# EAGLE design adapter (EAGLE 5.10)
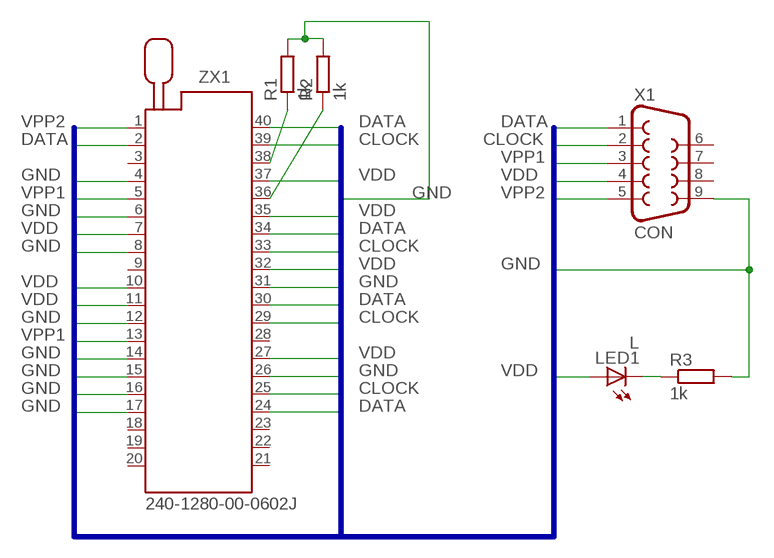
[diagram p0: schematic, sheet 1]

## Parts
LED1  L  LED5MM  [LED5MM]
R1  1k  R-EU_0204/7  [0204/7]
R2  1k  R-EU_0204/7  [0204/7]
R3  1k  R-EU_0204/7  [0204/7]
X1  CON  F09HP  [F09HP]
ZX1  240-1280-00-0602J  [240-1280-00-0602J]

## Nets
CLOCK: X1.2 ZX1.25 ZX1.29 ZX1.33 ZX1.39
DATA: X1.1 ZX1.2 ZX1.24 ZX1.30 ZX1.34 ZX1.40
GND: R1.2 R2.2 R3.2 X1.9 ZX1.4 ZX1.6 ZX1.8 ZX1.12 ZX1.14 ZX1.15 ZX1.16 ZX1.17 ZX1.26 ZX1.31
N$1: LED1.K(C) R3.1
N$2: R1.1 ZX1.38
N$3: R2.1 ZX1.36
VDD: LED1.A X1.4 ZX1.7 ZX1.10 ZX1.11 ZX1.27 ZX1.32 ZX1.35 ZX1.37
VPP1: X1.3 ZX1.5 ZX1.13
VPP2: X1.5 ZX1.1
Unconnected: X1.6 X1.7 X1.8 ZX1.3 ZX1.9 ZX1.18 ZX1.19 ZX1.20 ZX1.21 ZX1.22 ZX1.23 ZX1.28

## Buses
DATA,CLOCK,VPP1,VDD,VPP2,GND

## Library data of the parts
LED1 = led:LED: LED OSRAM: - CHIPLED LG R971, LG N971, LY N971, LG Q971, LY Q971, LO R971, LY R971 LH N974, LH R974 LS Q976, LO Q976, LY Q976 LO Q996 - Hyper CHIPLED LW Q18S LB Q993, LB Q99A, LB R99A - SideLED LS A670, LO A670, LY A670, LG A670, LP A670 LB A673, LV A673, LT A673, LW A673 LH A674 LY A675 LS A676, LA A676, LO A676, LY A676, LW A676 LS A679, LY A679, LG A679 - Hyper Micro SIDELED® LS Y876, LA Y876, LO Y876, LY Y876 LT Y87S - SmartLED LW L88C, LW L88S LB L89C, LB L89S, LG L890 LS L89K, LO L89K, LY L89K LS L896, LA L896, LO L896, LY L896 - TOPLED LS T670, LO T670, LY T670, LG T670, LP T670 LSG T670, LSP T670, LSY T670, LOP T670, LYG T670 LG T671, LOG T671, LSG T671 LB T673, LV T673, LT T673, LW T673 LH T674 LS T676, LA T676, LO T676, LY T676, LB T676, LH T676, LSB T676, LW T676 LB T67C, LV T67C, LT T67C, LS T67K, LO T67K, LY T67K, LW E67C LS E67B, LA E67B, LO E67B, LY E67B, LB E67C, LV E67C, LT E67C LW T67C LS T679, LY T679, LG T679 LS T770, LO T770, LY T770, LG T770, LP T770 LB T773, LV T773, LT T773, LW T773 LH T774 LS E675, LA E675, LY E675, LS T675 LS T776, LA T776, LO T776, LY T776, LB T776 LHGB T686 LT T68C, LB T68C - Hyper Mini TOPLED® LB M676 - Mini TOPLED Santana® LG M470 LS M47K, LO M47K, LY M47K Source: http://www.osram.convergy.de LUXEON: - LUMILED® LXK2-PW12-R00, LXK2-PW12-S00, LXK2-PW14-U00, LXK2-PW14-V00 LXK2-PM12-R00, LXK2-PM12-S00, LXK2-PM14-U00 LXK2-PE12-Q00, LXK2-PE12-R00, LXK2-PE12-S00, LXK2-PE14-T00, LXK2-PE14-U00 LXK2-PB12-K00, LXK2-PB12-L00, LXK2-PB12-M00, LXK2-PB14-N00, LXK2-PB14-P00, LXK2-PB14-Q00 LXK2-PR12-L00, LXK2-PR12-M00, LXK2-PR14-Q00, LXK2-PR14-R00 LXK2-PD12-Q00, LXK2-PD12-R00, LXK2-PD12-S00 LXK2-PH12-R00, LXK2-PH12-S00 LXK2-PL12-P00, LXK2-PL12-Q00, LXK2-PL12-R00 Source: www.luxeon.com KINGBRIGHT: KA-3528ASYC Source: www.kingbright.com
R1-R3 = resistor:R-EU_: RESISTOR, European symbol
X1 = con-subd:F09: SUB-D
ZX1 = con-3m:240-?-00-0602J: Zero Insertion Force Socked Source: http://www.3M.com/ehpd

## Board
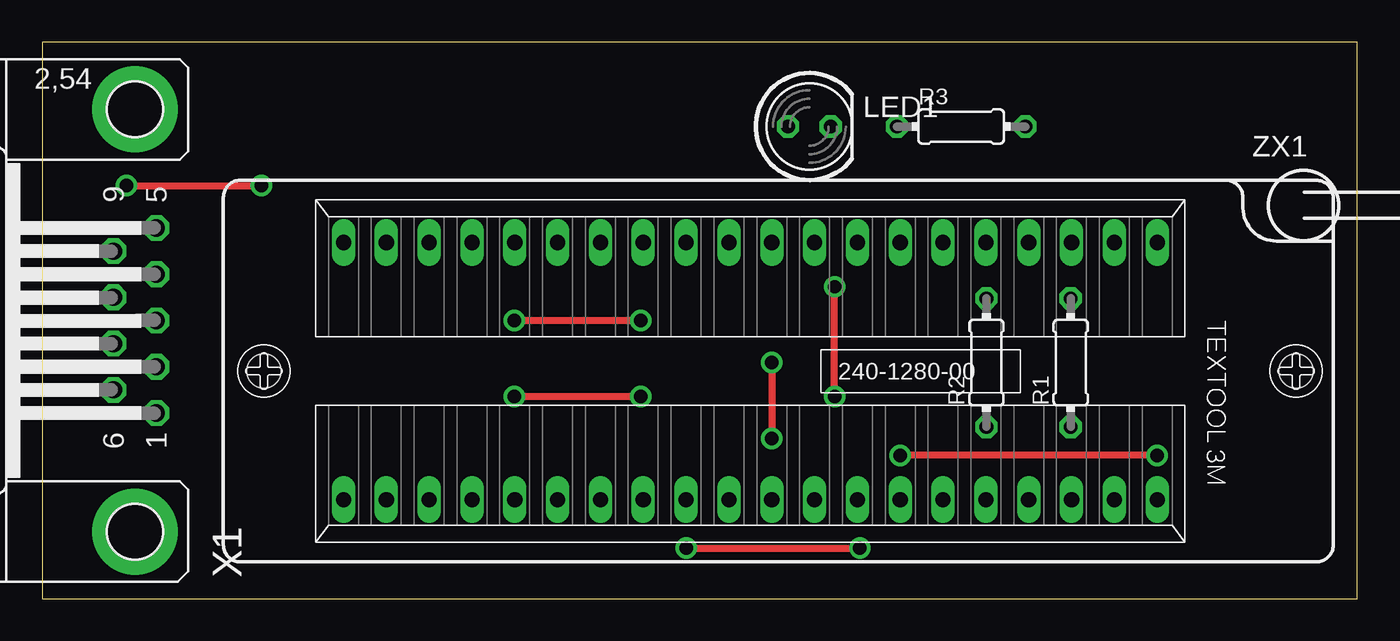
[diagram p1: board, top side]
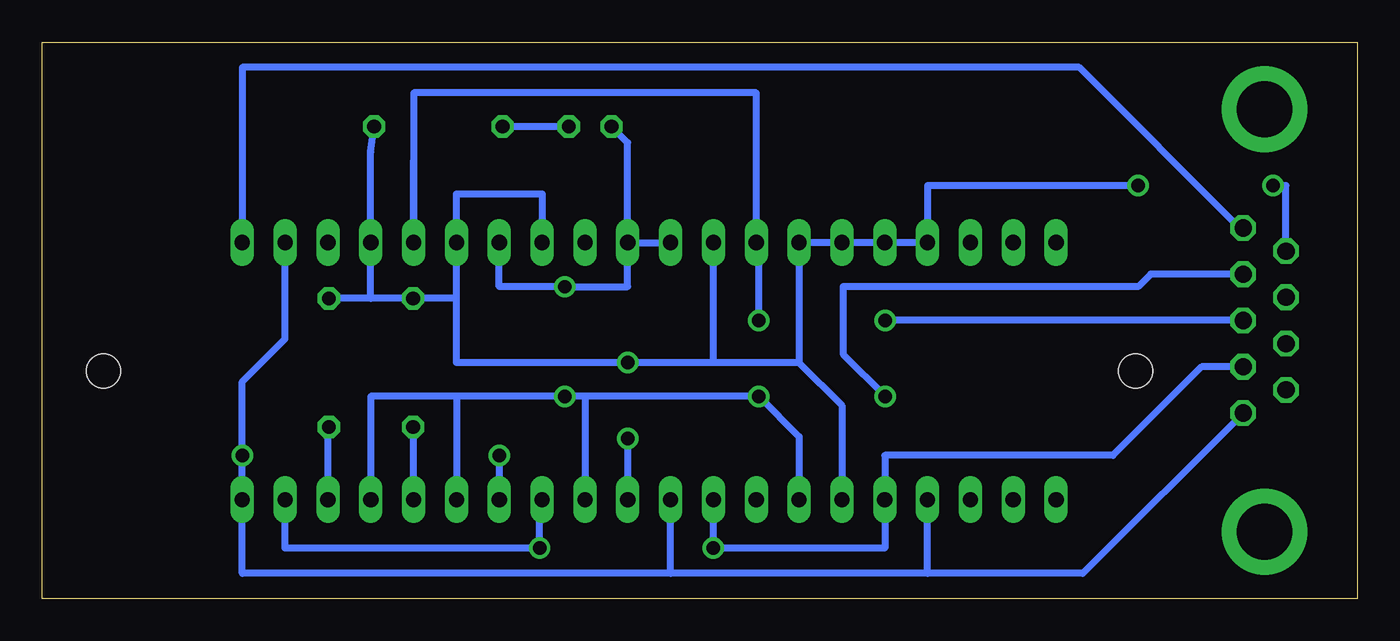
[diagram p2: board, bottom side, seen from below]

Size 78 x 33 mm. Coordinates in mm from the lower left corner, seen from the top.
Outline: 0,0 78,0 78,33 0,33 0,0
Copper layers (1*16): Top 0.035mm / dielectric 1.5mm / Bottom 0.035mm
Design rules "default": minimum track width 10mil, minimum drill 24mil, track to track 8mil, track to pad 8mil, pad to pad 8mil, via to via 8mil, smd to smd 8mil, copper to edge 40mil, drill to drill 8mil, minimum pad ring 10mil, minimum via ring 8mil, stop-mask expansion 4mil, vias tented up to drill 0mil, thermal gap 10mil

### Footprints (pad centres in the part's own frame; a part is rotated, then mirrored left to right if it is on the bottom)
LED5MM = drill 0.813 octagon: A -1.27,0; K 1.27,0
0204/7 = drill 0.813 octagon: 1 -3.81,0; 2 3.81,0
F09HP = drill 1.016 octagon: 1 -5.486,-1.27; 2 -2.743,-1.27; 3 0,-1.27; 4 2.743,-1.27; 5 5.486,-1.27; 6 -4.115,1.27; 7 -1.372,1.27; 8 1.372,1.27; 9 4.115,1.27 | drill 3.302 pad 5.08 round: G1 -12.522,0; G2 12.522,0
240-1280-00-0602J = drill 0.9 long: 1 -24.13,-7.62; 2 -21.59,-7.62; 3 -19.05,-7.62; 4 -16.51,-7.62; 5 -13.97,-7.62; 6 -11.43,-7.62; 7 -8.89,-7.62; 8 -6.35,-7.62; 9 -3.81,-7.62; 10 -1.27,-7.62; 11 1.27,-7.62; 12 3.81,-7.62; 13 6.35,-7.62; 14 8.89,-7.62; 15 11.43,-7.62; 16 13.97,-7.62; 17 16.51,-7.62; 18 19.05,-7.62; 19 21.59,-7.62; 20 24.13,-7.62; 21 24.13,7.62; 22 21.59,7.62; 23 19.05,7.62; 24 16.51,7.62; 25 13.97,7.62; 26 11.43,7.62; 27 8.89,7.62; 28 6.35,7.62; 29 3.81,7.62; 30 1.27,7.62; 31 -1.27,7.62; 32 -3.81,7.62; 33 -6.35,7.62; 34 -8.89,7.62; 35 -11.43,7.62; 36 -13.97,7.62; 37 -16.51,7.62; 38 -19.05,7.62; 39 -21.59,7.62; 40 -24.13,7.62 | hole 2: 28.86,0; -32.36,0

### Placement (x,y rotation side)
LED1  45.5,28 0 top
R1  61,14 90 top
R2  56,14 90 top
R3  54.5,28 0 top
X1  5.5,16.5 90 top
ZX1  42,13.5 180 top

### Tracks (layer width: path | path; a pad name or v marks a point on that pad's centre or on a via)
CLOCK  (via drill 0.8 pad 1.27)
  Top 0.406: v38.19,3 v48.5,3
  Bottom 0.406: ZX1.29 v38.19,3 28.03,3 ZX1.25 28.03,8.5 14.5,8.5 9.24,13.76 X1.2 | ZX1.39 63.59,3 v48.5,3 48.5,5.88 ZX1.33
DATA  (via drill 0.8 pad 1.27)
  Top 0.406: v66.13,8.5 v50.89,8.5
  Bottom 0.406: 40.73,1.5 66.13,1.5 ZX1.40 v66.13,8.5 66.13,12.87 63.59,15.41 ZX1.2 | 40.73,1.5 ZX1.30 | 25.49,1.5 40.73,1.5 | 25.49,1.5 ZX1.24 | X1.1 16.28,1.5 25.49,1.5 | v50.89,8.5 ZX1.34
GND  (via drill 0.8 pad 1.27)
  Top 0.406: v43.27,14 v43.27,9.5 | v5,24.5 v13,24.5
  Bottom 0.406: 33.11,14 ZX1.14 ZX1.15 ZX1.16 ZX1.17 25.49,24.5 v13,24.5 | 33.11,14 38.19,14 | 58.51,17.81 ZX1.4 58.51,26.5 R3.2 | 58.51,17.81 R2.2 53.43,17.81 | ZX1.8 48.35,24 53.43,24 ZX1.6 53.43,17.81 | 58.51,17.81 R1.2 | 38.19,14 v43.27,14 53.43,14 53.43,17.81 | 38.19,14 ZX1.12 | v43.27,9.5 ZX1.31 | ZX1.26 30.57,11.46 33.11,14 | X1.9 4.23,24.5 v5,24.5
N$1
  Bottom 0.406: LED1.K R3.1
N$2
  Bottom 0.406: R1.1 61.05,9.69 ZX1.38
N$3
  Bottom 0.406: R2.1 55.97,9.69 ZX1.36
VDD  (via drill 0.8 pad 1.27)
  Top 0.406: v47,12 v47,18.5 | v28,12 v35.5,12
  Bottom 0.406: ZX1.7 50.89,18.5 v47,18.5 43.27,18.5 ZX1.10 | ZX1.10 ZX1.11 | 53.43,12 ZX1.35 | 45.81,12 v47,12 53.43,12 | 45.81,12 ZX1.32 | ZX1.37 58.51,12 53.43,12 | X1.4 12.26,19.24 13,18.5 30.5,18.5 30.5,14.5 v28,12 | LED1.A 43.27,27.04 ZX1.10 | 45.81,12 v35.5,12 33.11,9.61 ZX1.27
VPP1  (via drill 0.8 pad 1.27)
  Top 0.406: v28,16.5 v35.5,16.5
  Bottom 0.406: 55.97,26 ZX1.5 55.97,30 35.65,30 ZX1.13 35.5,21.12 v35.5,16.5 | X1.3 v28,16.5
VPP2
  Bottom 0.406: ZX1.1 66.13,31.5 16.5,31.5 6.99,21.99 X1.5